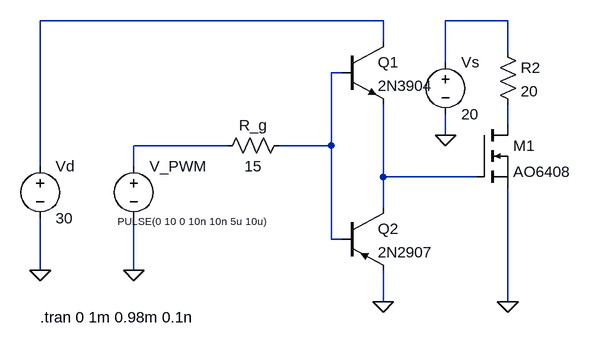
[diagram p0: schematic Draft1.asc]
Draft1.asc, the LTspice schematic file:
Version 4
SHEET 1 880 680
WIRE 432 -96 -96 -96
WIRE 624 -96 528 -96
WIRE 432 -64 432 -96
WIRE 624 -48 624 -96
WIRE 528 -32 528 -96
WIRE 368 -16 352 -16
WIRE 624 64 624 32
WIRE 528 80 528 48
WIRE 192 96 48 96
WIRE 352 96 352 -16
WIRE 352 96 272 96
WIRE -96 128 -96 -96
WIRE 48 128 48 96
WIRE 432 144 432 32
WIRE 576 144 432 144
WIRE 432 192 432 144
WIRE 352 240 352 96
WIRE 368 240 352 240
WIRE -96 288 -96 208
WIRE 48 288 48 208
WIRE 432 336 432 288
WIRE 624 336 624 160
FLAG 48 288 0
FLAG -96 288 0
FLAG 432 336 0
FLAG 624 336 0
FLAG 528 80 0
SYMBOL voltage 48 112 R0
WINDOW 3 -25 100 Left 1
WINDOW 123 0 0 Left 0
WINDOW 39 0 0 Left 0
SYMATTR InstName V_PWM
SYMATTR Value PULSE(0 10 0 10n 10n 5u 10u)
SYMBOL res 288 80 R90
WINDOW 0 0 56 VBottom 2
WINDOW 3 32 56 VTop 2
SYMATTR InstName R_g
SYMATTR Value 15
SYMBOL npn 368 -64 R0
SYMATTR InstName Q1
SYMATTR Value 2N3904
SYMBOL pnp 368 192 R0
SYMATTR InstName Q2
SYMATTR Value 2N2907
SYMBOL nmos 576 64 R0
SYMATTR InstName M1
SYMATTR Value AO6408
SYMBOL voltage -96 112 R0
WINDOW 123 0 0 Left 0
WINDOW 39 0 0 Left 0
SYMATTR InstName Vd
SYMATTR Value 30
SYMBOL voltage 528 -48 R0
WINDOW 123 0 0 Left 0
WINDOW 39 0 0 Left 0
SYMATTR InstName Vs
SYMATTR Value 20
SYMBOL res 608 -64 R0
SYMATTR InstName R2
SYMATTR Value 20
TEXT -96 360 Left 2 !.tran 0 1m 0.98m 0.1n

The netlist it stands for:
* Draft1.asc
V_PWM N005 0 PULSE(0 10 0 10n 10n 5u 10u)
R_g N003 N005 15
Q1 N001 N003 N006 0 2N3904
Q2 N006 N003 0 0 2N2907
M1 N004 N006 0 0 AO6408
Vd N001 0 30
Vs N002 0 20
R2 N002 N004 20
.model NPN NPN
.model PNP PNP
.lib standard.bjt
.model NMOS NMOS
.model PMOS PMOS
.lib standard.mos
.tran 0 1m 0.98m 0.1n
.backanno
.end